# EasyEDA Pro project PCB_Source.epro

# Schematic Schematic1
Board Name: Board1; Create Date: 2026-05-20; Page Name: P1; Project Name: pcbwatch; Schematic Name: Schematic1; Update Date: 2026-05-27; Company: EasyEDA.com; Page Size: A4; Version: V1.0
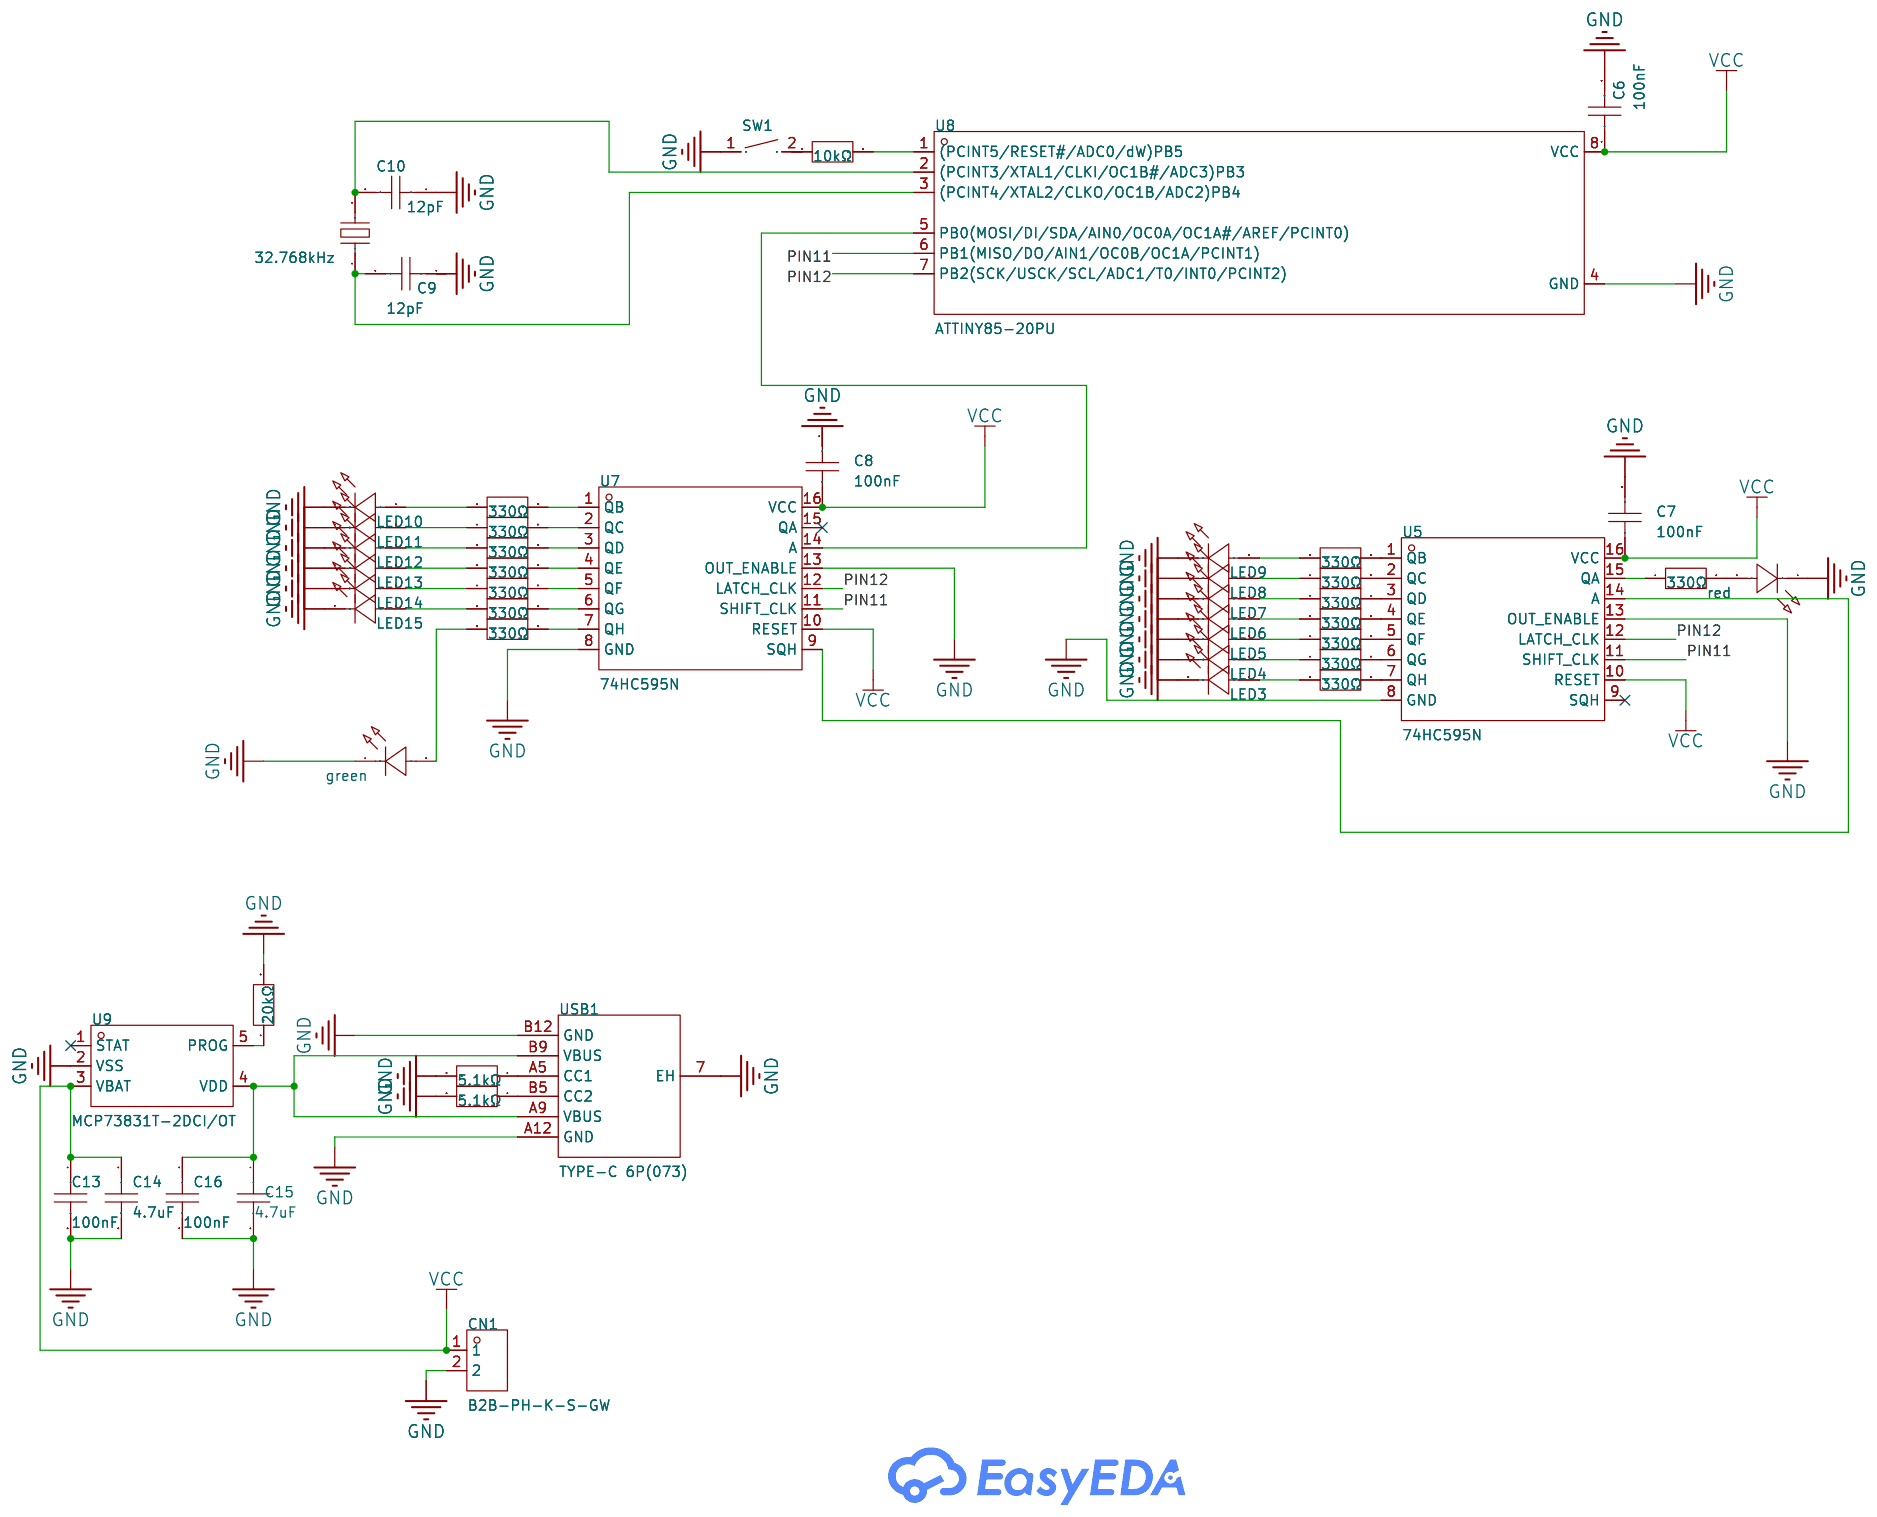
[diagram p0: schematic sheet]

## Parts
C6  100nF  [CAP-TH_L5.8-W2.4-P2.54-D0.6]
C7  100nF  [CAP-TH_L5.8-W2.4-P2.54-D0.6]
C8  100nF  [CAP-TH_L5.8-W2.4-P2.54-D0.6]
C9  12pF  [CAP-TH_L5.8-W2.4-P2.54-D0.6]
C10  12pF  [CAP-TH_L5.8-W2.4-P2.54-D0.6]
C13  100nF  [CAP-TH_L5.8-W2.4-P2.54-D0.6]
C14  4.7uF  [CAP-TH_L5.8-W2.4-P2.54-D0.6]
C15  4.7uF  [CAP-TH_L5.8-W2.4-P2.54-D0.6]
C16  100nF  [CAP-TH_L5.8-W2.4-P2.54-D0.6]
CN1  B2B-PH-K-S-GW  [CONN-TH_B2B-PH-K-S]
green  TJ-S2012EX8T5ALC2R-A5  [LED0805-RD]
LED3  TJ-S2012EX8T5ALC2R-A5  [LED0805-RD]
LED4  TJ-S2012EX8T5ALC2R-A5  [LED0805-RD]
LED5  TJ-S2012EX8T5ALC2R-A5  [LED0805-RD]
LED6  TJ-S2012EX8T5ALC2R-A5  [LED0805-RD]
LED7  TJ-S2012EX8T5ALC2R-A5  [LED0805-RD]
LED8  TJ-S2012EX8T5ALC2R-A5  [LED0805-RD]
LED9  TJ-S2012EX8T5ALC2R-A5  [LED0805-RD]
LED10  TJ-S2012EX8T5ALC2R-A5  [LED0805-RD]
LED11  TJ-S2012EX8T5ALC2R-A5  [LED0805-RD]
LED12  TJ-S2012EX8T5ALC2R-A5  [LED0805-RD]
LED13  TJ-S2012EX8T5ALC2R-A5  [LED0805-RD]
LED14  TJ-S2012EX8T5ALC2R-A5  [LED0805-RD]
LED15  TJ-S2012EX8T5ALC2R-A5  [LED0805-RD]
R20  330Ω  [RES-TH_BD2.3-L6.5-P10.50-D0.5]
R21  330Ω  [RES-TH_BD2.3-L6.5-P10.50-D0.5]
R22  330Ω  [RES-TH_BD2.3-L6.5-P10.50-D0.5]
R23  330Ω  [RES-TH_BD2.3-L6.5-P10.50-D0.5]
R24  330Ω  [RES-TH_BD2.3-L6.5-P10.50-D0.5]
R25  330Ω  [RES-TH_BD2.3-L6.5-P10.50-D0.5]
R26  330Ω  [RES-TH_BD2.3-L6.5-P10.50-D0.5]
R27  330Ω  [RES-TH_BD2.3-L6.5-P10.50-D0.5]
R28  330Ω  [RES-TH_BD2.3-L6.5-P10.50-D0.5]
R29  330Ω  [RES-TH_BD2.3-L6.5-P10.50-D0.5]
R30  330Ω  [RES-TH_BD2.3-L6.5-P10.50-D0.5]
R31  330Ω  [RES-TH_BD2.3-L6.5-P10.50-D0.5]
R32  330Ω  [RES-TH_BD2.3-L6.5-P10.50-D0.5]
R33  330Ω  [RES-TH_BD2.3-L6.5-P10.50-D0.5]
R34  330Ω  [RES-TH_BD2.3-L6.5-P10.50-D0.5]
R36  10kΩ  [RES-TH_BD2.3-L6.5-P10.50-D0.5]
R40  20kΩ  [RES-TH_BD2.3-L6.5-P10.50-D0.5]
R41  5.1kΩ  [RES-TH_BD2.3-L6.5-P10.50-D0.5]
R42  5.1kΩ  [RES-TH_BD2.3-L6.5-P10.50-D0.5]
red  TJ-S2012EX8T5ALC2R-A5  [LED0805-RD]
SW1  HX 3x4x2-2P-1.6N TACTILE SWITCH  [KEY-SMD_L4.0-W3.0-LS4.9-1]
U5  74HC595N  [DIP-16_L19.8-W6.5-P2.54-LS7.6-BL]
U7  74HC595N  [DIP-16_L19.8-W6.5-P2.54-LS7.6-BL]
U8  ATTINY85-20PU  [PDIP-8_L9.3-W6.4-P2.54-LS7.9-BL-1]
U9  MCP73831T-2DCI/OT  [SOT-23-5_L2.9-W1.6-P0.95-LS2.8-BL]
USB1  TYPE-C 6P(073)  [TYPE-C-SMD_TYPE-C-6P-073]
X1  32.768kHz  [OSC-TH_BD2.0-P0.70-D0.3]

## Library data of the parts
C6-C10 C13-C16 = CC1H104ZA1ED3F5P1100: Capacitance:100nF Tolerance:-20%~+80% Tolerance:-20%~+80% Voltage Rating:50V Pin Spacing:2.54mm Temperature Coefficient:Y5V Diameter:5.8mm Body Thickness:2.4mm; LCSC Part Name: 100nF -20%~+80% 50V; Supplier Part: C2832506; Manufacturer: Dersonic(德尔创); Supplier Footprint: 插件,P=2.54mm; JLCPCB Part Class: Extended Part; Datasheet: https://item.szlcsc.com/datasheet/CC1H104ZA1ED3F5P1100/2990644.html; Supplier: LCSC; Tolerance: -20%~+80%; Voltage Rating: 50V; Pin Spacing: 2.54mm; Temperature Coefficient: Y5V; Diameter: 5.8mm; Body Thickness: 2.4mm
CN1 = B2B-PH-K-S-GW: Pins Structure:1x2P Pitch:2mm Mounting Type:Through Hole Reference Series:PH Number of Pins:2P Number of Rows:1 Number of PINs Per Row:2 Row Spacing:- Current Rating:2A Contact Material:Brass Contact Plating:Tin Operating Temperature:-25℃~+85℃ Operating T; LCSC Part Name: 1x2P 间距:2mm 直插 系列:PH; Supplier Part: C5251182; Manufacturer: JST; Supplier Footprint: 插件,P=2mm; JLCPCB Part Class: Extended Part; Datasheet: https://item.szlcsc.com/datasheet/B2B-PH-K-S-GW/5967705.html; Supplier: LCSC; Pins Structure: 1x2P; Pitch: 2mm; Mounting Type: Through Hole; Reference Series: PH; Number of Pins: 2P; Number of Rows: 1; Number of PINs Per Row: 2; Current Rating: 2A; Contact Material: Brass; Contact Plating: Tin; Operating Temperature: -25℃~+85℃; Voltage Rating: 100V; Plastic Material: PA66; Flame Retardant Rating: UL94V-0; Supplementary Features: K Pin; Color: White; Z-Height of the Board: 6mm; X-Length of Bottom Edge on Board (Spacing Line): 5.9mm; Y-Width of Bottom Edge on Board: 4.5mm
green LED3-LED15 red = TJ-S2012EX8T5ALC2R-A5: Lamp Holder Type:2mm x 1.25mm square LED Illumination Color:Red Voltage - Forward(Vf):1.8V~2.4V Voltage - Forward(Vf):1.8V~2.4V Power(Watts):48mW Forward Current:20mA Wavelength - Dominant:620nm~630nm Wavelength - Dominant:620nm~630nm Peak Wavelength:631n; LCSC Part Name: SMD0805灯珠红光; Supplier Part: C48689647; Manufacturer: TOGIALED(统佳); Supplier Footprint: 0805; JLCPCB Part Class: Extended Part; Datasheet: https://item.szlcsc.com/datasheet/TJ-S2012EX8T5ALC2R-A5/50980865.html; Supplier: LCSC; Lamp Holder Type: 2mm x 1.25mm square LED; Illumination Color: Red; Voltage - Forward(Vf): 1.8V~2.4V; Power(Watts): 48mW; Forward Current: 20mA; Wavelength - Dominant: 620nm~630nm; Peak Wavelength: 631nm; Diode Configuration: Discrete Diode; Lens Color: Water Clear; Luminous Intensity: 200mcd; Viewing Angle: 120°; Operating Temperature: -40℃~+80℃
R20-R34 R36 R40-R42 = MF1/4W-1KΩ±1%T52: Type:Metal Film Resistors Resistance: Tolerance:±1% Tolerance:±1% Power(Watts):250mW Temperature Coefficient:±200ppm/℃ Temperature Coefficient:±200ppm/℃; LCSC Part Name: 金属膜电阻 1kΩ ±1% 250mW; Supplier Part: C713997; Manufacturer: 华星机电; Supplier Footprint: 插件,D2.3xL6.5mm; JLCPCB Part Class: Extended Part; Datasheet: https://atta.szlcsc.com/upload/public/pdf/source/20200731/C713882_AE8EB1102749D7E4FB4FB13DC898C429.pdf; Supplier: LCSC; Type: Metal Film Resistors; Tolerance: ±1%; Power(Watts): 250mW; Temperature Coefficient: ±200ppm/℃
SW1 = HX 3x4x2-2P-1.6N TACTILE SWITCH: Circuit:SPST Actuator Style:Round Button Operating Force:1.6N Mounting Type:Surface Mount,Vertical Length:4mm Width:3mm Switch Height:2mm with Bracket:Without Bracket Contact Current:50mA Voltage Rating:12V Actuator/Cap Color:Black With Lamp:No IP Rating:; LCSC Part Name: 4*3*2mm 立贴 轻触开关; Supplier Part: C49234124; Manufacturer: hanxia(韩下); Supplier Footprint: SMD; JLCPCB Part Class: Extended Part; Datasheet: https://item.szlcsc.com/datasheet/HX%25203x4x2-2P-1.6N%2520TACTILE%2520SWITCH/51650185.html; Supplier: LCSC; Circuit: SPST; Actuator Style: Round Button; Operating Force: 1.6N; Mounting Type: Surface Mount,Vertical; Length: 4mm; Width: 3mm; Switch Height: 2mm; with Bracket: Without Bracket; Contact Current: 50mA; Voltage Rating: 12V; Actuator/Cap Color: Black; With Lamp: No; Termination Style: SMD(SMT) Tab; Life: 100,000 Cycles
U5 U7 = 74HC595N: Function:Serial-to-Serial or Parallel Voltage - Supply:2V~6V Voltage - Supply:2V~6V Clock Frequency:28MHz Number of Elements:1 Number of Bits per Element:8 Output Type:Tri-State Series:74HC Operating Temperature:-55℃~+125℃ Operating Temperature:-55℃~+125℃; LCSC Part Name: 停产 74HC595N; Supplier Part: C669328; Manufacturer: HTC; Supplier Footprint: DIP-16; JLCPCB Part Class: Extended Part; Datasheet: https://item.szlcsc.com/datasheet/74HC595N/699730.html; Supplier: LCSC; Function: Serial-to-Serial or Parallel; Voltage - Supply: 2V~6V; Clock Frequency: 28MHz; Number of Elements: 1; Number of Bits per Element: 8; Output Type: Tri-State; Series: 74HC; Operating Temperature: -55℃~+125℃
U8 = ATTINY85-20PU: CPU Core:AVR CPU Maximum Speed:20MHz Core Size:8 Bit Program Storage Size:8KB Program Memory Type:FLASH RAM Size:512Byte EEPROM:512Byte Number of I/O:6 ADC (Bit):10bit Oscillator Type:Built-in Voltage - Supply:2.7V~5.5V Voltage - Supply:2.7V~5.5V Operatin; Supplier Part: C965497; Manufacturer: MICROCHIP(美国微芯); Supplier Footprint: PDIP-8; JLCPCB Part Class: Extended Part; Datasheet: https://item.szlcsc.com/datasheet/ATTINY85-20PU/1052792.html; Supplier: LCSC; CPU Core: AVR; CPU Maximum Speed: 20MHz; Core Size: 8 Bit; Program Storage Size: 8KB; Program Memory Type: FLASH; RAM Size: 512Byte; EEPROM: 512Byte; Number of I/O: 6; ADC (Bit): 10bit; Oscillator Type: Built-in; Voltage - Supply: 2.7V~5.5V; Operating Temperature: -40℃~+85℃
U9 = MCP73831T-2DCI/OT: The Chip Type:Charging IC Voltage - Supply:3.75V~6V Voltage - Supply:3.75V~6V Charge Current - Max:550mA Charging Saturation Voltage:4.2V End-Off Voltage:- Type of Battery:Lithium Battery Number of Cells:1 Number of Cells:1 Operating Temperature:-40℃~+85℃; LCSC Part Name: 单节全集成锂离子/锂聚合物充电管理控制器; Supplier Part: C625597; Manufacturer: MICROCHIP(美国微芯); Supplier Footprint: SOT-23-5; JLCPCB Part Class: Extended Part; Datasheet: https://item.szlcsc.com/datasheet/MCP73831T-2DCI%252FOT/655504.html; Supplier: LCSC; The Chip Type: Charging IC; Voltage - Supply: 3.75V~6V; Charge Current - Max: 550mA; Charging Saturation Voltage: 4.2V; Type of Battery: Lithium Battery; Number of Cells: 1; Operating Temperature: -40℃~+85℃; Battery Temperature Detection: Not supported; Supply Current (Iq): 53uA
USB1 = TYPE-C 6P(073): Connector Type:Type-C Protocol Standard:- Gender:Female Mounting Type:Surface Mount, Right Angle Number of Contacts:6P Number of Ports:1 Current Rating-Power:3A Voltage Rating:5V Connect-Disconnect Life:10,000 Cycles Supplementary Features:- Center Height; LCSC Part Name: 6P卧贴母座; Supplier Part: C668623; Manufacturer: SHOU HAN(首韩); Supplier Footprint: SMD; JLCPCB Part Class: Extended Part; Datasheet: https://item.szlcsc.com/datasheet/TYPE-C%25206P(073)/698566.html; Supplier: LCSC; Connector Type: Type-C; Gender: Female; Mounting Type: Surface Mount, Right Angle; Number of Contacts: 6P; Number of Ports: 1; Current Rating-Power: 3A; Voltage Rating: 5V; Connect-Disconnect Life: 10,000 Cycles; Detection color: Black; Operating Temperature: -25℃~+85℃
X1 = TAXD32768K2BGBBZT2S: Type:Through Hole Crystal Oscillator Frequency:32.768kHz Normal temperature Frequency Tolerance:±10ppm Normal temperature Frequency Tolerance:±10ppm Load Capacitance:12.5pF Frequency Stability:±20ppm Frequency Stability:±20ppm Equivalent Series Resistance; LCSC Part Name: 32.768kHz ±10ppm 12.5pF; Supplier Part: C511702; Manufacturer: YJX(雅晶鑫); Supplier Footprint: DT-26; JLCPCB Part Class: Extended Part; Datasheet: https://item.szlcsc.com/datasheet/TAXD32768K2BGBBZT2S/526449.html; Supplier: LCSC; Type: Through Hole Crystal Oscillator; Normal temperature Frequency Tolerance: ±10ppm; Load Capacitance: 12.5pF; Frequency Stability: ±20ppm; Equivalent Series Resistance(ESR): 40kΩ; Operating Temperature: -20℃~+70℃

## Nets
GND: C6.2 C7.2 C8.1 C9.1 C10.1 C13.2 C14.2 C15.2 C16.2 CN1.2 green.1(C) LED3.1(C) LED4.1(C) LED5.1(C) LED6.1(C) LED7.1(C) LED8.1(C) LED9.1(C) LED10.1(C) LED11.1(C) LED12.1(C) LED13.1(C) LED14.1(C) LED15.1(C) R40.2 R41.2 R42.2 red.1(C) SW1.1 U5.8(GND) U5.13(OUT_ENABLE) U7.8(GND) U7.13(OUT_ENABLE) U8.4(GND) U9.2(VSS) USB1.7(EH) USB1.A12(GND) USB1.B12(GND)
VCC: C6.1 C7.1 C8.2 C13.1 C14.1 CN1.1 U5.10(RESET) U5.16(VCC) U7.10(RESET) U7.16(VCC) U8.8(VCC) U9.3(VBAT)
PIN11: U5.11(SHIFT_CLK) U7.11(SHIFT_CLK) U8.6(PB1(MISO/DO/AIN1/OC0B/OC1A/PCINT1))
PIN12: U5.12(LATCH_CLK) U7.12(LATCH_CLK) U8.7(PB2(SCK/USCK/SCL/ADC1/T0/INT0/PCINT2))
$1N1454: U7.14(A) U8.5(PB0(MOSI/DI/SDA/AIN0/OC0A/OC1A#/AREF/PCINT0))
$1N1740: U5.14(A) U7.9(SQH)
$1N15518: R40.1 U9.5(PROG)
Net-(C9-2): C9.2 U8.3((PCINT4/XTAL2/CLKO/OC1B/ADC2)PB4) X1.1
Net-(C10-2): C10.2 U8.2((PCINT3/XTAL1/CLKI/OC1B#/ADC3)PB3) X1.2
Net-(C15-1): C15.1 C16.1 U9.4(VDD) USB1.A9(VBUS) USB1.B9(VBUS)
Net-(green-2): green.2(A) R26.1
Net-(LED3-2): LED3.2(A) R33.1
Net-(LED4-2): LED4.2(A) R32.1
Net-(LED5-2): LED5.2(A) R31.1
Net-(LED6-2): LED6.2(A) R30.1
Net-(LED7-2): LED7.2(A) R29.1
Net-(LED8-2): LED8.2(A) R28.1
Net-(LED9-2): LED9.2(A) R27.1
Net-(LED10-2): LED10.2(A) R20.1
Net-(LED11-2): LED11.2(A) R21.1
Net-(LED12-2): LED12.2(A) R22.1
Net-(LED13-2): LED13.2(A) R23.1
Net-(LED14-2): LED14.2(A) R24.1
Net-(LED15-2): LED15.2(A) R25.1
Net-(R20-2): R20.2 U7.1(QB)
Net-(R21-2): R21.2 U7.2(QC)
Net-(R22-2): R22.2 U7.3(QD)
Net-(R23-2): R23.2 U7.4(QE)
Net-(R24-2): R24.2 U7.5(QF)
Net-(R25-2): R25.2 U7.6(QG)
Net-(R26-2): R26.2 U7.7(QH)
Net-(R27-2): R27.2 U5.1(QB)
Net-(R28-2): R28.2 U5.2(QC)
Net-(R29-2): R29.2 U5.3(QD)
Net-(R30-2): R30.2 U5.4(QE)
Net-(R31-2): R31.2 U5.5(QF)
Net-(R32-2): R32.2 U5.6(QG)
Net-(R33-2): R33.2 U5.7(QH)
Net-(R34-1): R34.1 U5.15(QA)
Net-(R34-2): R34.2 red.2(A)
Net-(R36-1): R36.1 SW1.2
Net-(R36-2): R36.2 U8.1((PCINT5/RESET#/ADC0/dW)PB5)
Net-(R41-1): R41.1 USB1.A5(CC1)
Net-(R42-1): R42.1 USB1.B5(CC2)

Not connected (* = marked no-connect by the designer): U5 9(SQH)*; U7 15(QA)*; U9 1(STAT)*

# Board PCB1
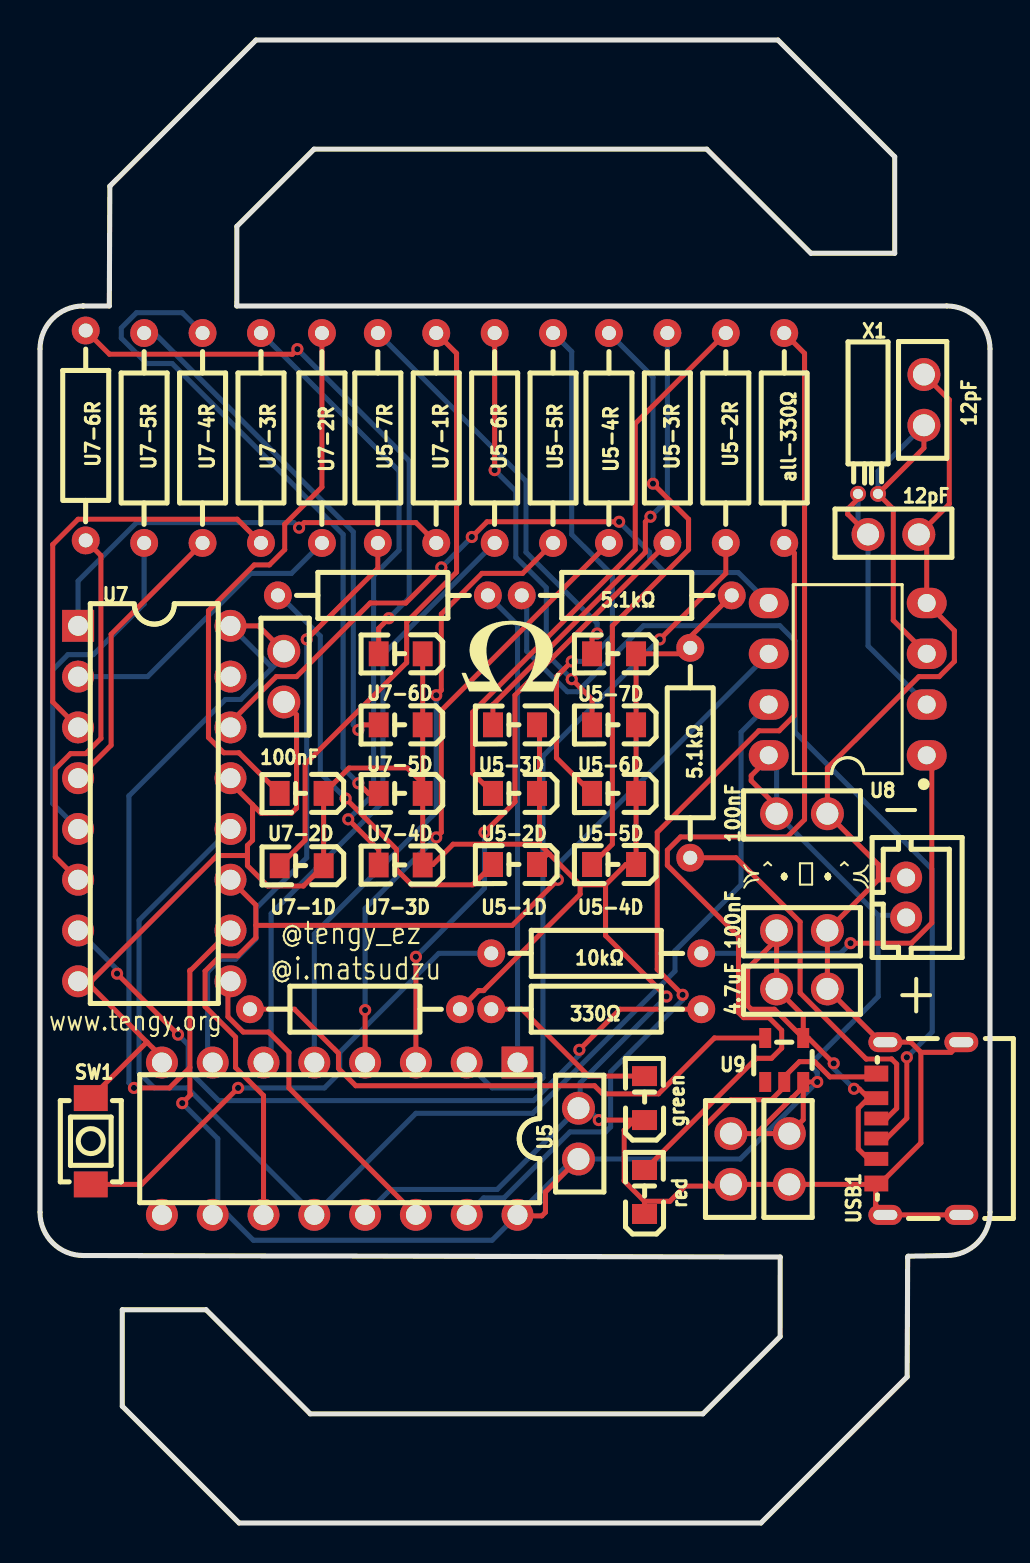
[diagram p1: board, top side]
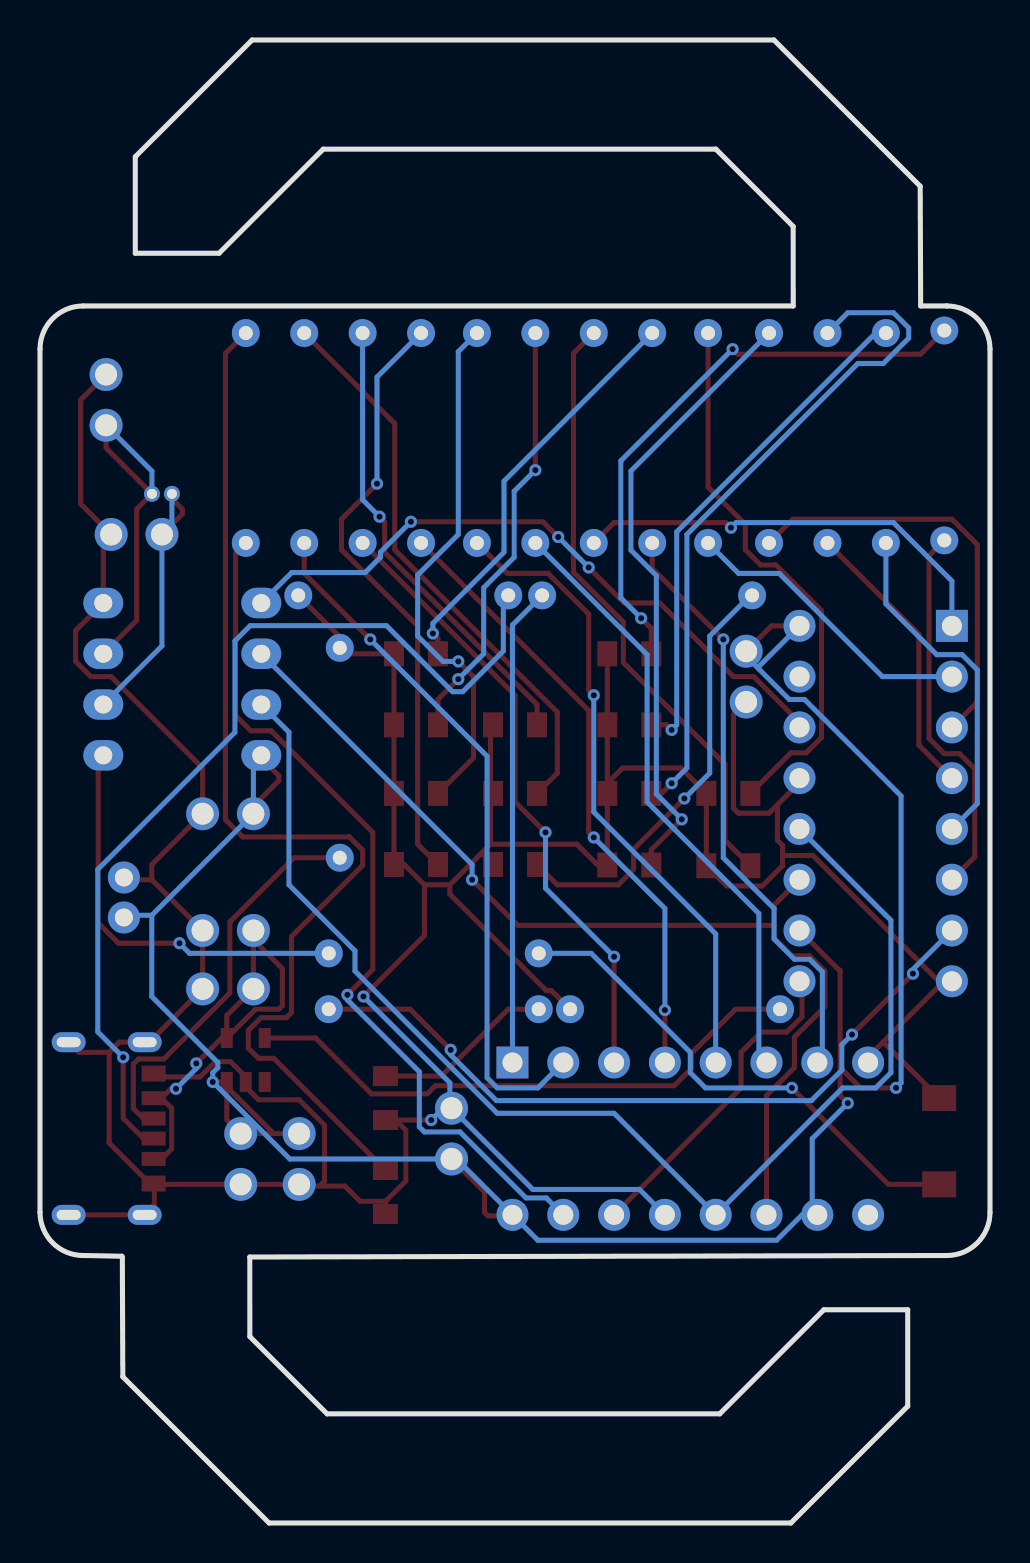
[diagram p2: board, bottom side, seen from below]

Outline 47.5 x 74.19 mm; copper layers: Top Layer, Bottom Layer. Coordinates in mm from the lower left corner of the outline.
Outline path: 0,58.72 arc(0.63,60.25) 2.16,60.88 2.15,60.88 3.47,60.88 3.49,66.87 10.8,74.19 36.89,74.19 42.73,68.35 42.73,63.52 38.54,63.52 33.34,68.73 13.71,68.73 9.84,64.86 9.84,60.88 45.34,60.88 arc(46.87,60.25) 47.5,58.72 47.5,15.54 arc(46.87,14.01) 45.34,13.38 43.41,13.35 43.38,13.31 43.36,7.31 36.05,0 9.96,0 4.11,5.84 4.11,10.67 8.31,10.67 13.51,5.46 33.14,5.46 37.01,9.33 37.01,13.31 2.16,13.38 arc(0.63,14.01) 0,15.54 0,58.72
Stack: Top Layer 0.035mm / Dielectric1 1.51mm FR4 er 4.5 / Bottom Layer 0.035mm

## Design rules (mm)
template: JLCPCB Capability(Two Layers Board)
spacing copperThickness1oz (default): track to track 0.102, other pairs 0.152 to 0.3
spacing copperThickness2oz: track to track 0.203, other pairs 0.152 to 0.3
track width copperThickness1oz (default): min 0.127, default 0.254, max 2.54
track width copperThickness2oz: min 0.203, default 0.254, max 2.54
differential pair differentialPair (default): width min 0.127, default 0.254, max 2.54; gap min 0.152, default 0.152
via viaSize (default): diameter min 0.5, default 0.61, max 10; hole min 0.3, default 0.305, max 6.3

## Placement (name value [footprint] x y rotation side)
3A  4.7uF  [CAP-TH_L5.8-W2.4-P2.54-D0.6]  37.47 18.21 270 top
3B  100nF  [CAP-TH_L5.8-W2.4-P2.54-D0.6]  34.54 18.21 270 top
4.7uF  4.7uF  [CAP-TH_L5.8-W2.4-P2.54-D0.6]  38.1 26.72 0 top
5.1kΩ  -  [RES-TH_BD2.3-L6.5-P10.50-D0.5]  29.34 46.4 0 top
5.1kΩ#2  -  [RES-TH_BD2.3-L6.5-P10.50-D0.5]  32.51 38.53 90 top
10kΩ  10kΩ  [RES-TH_BD2.3-L6.5-P10.50-D0.5]  27.81 28.5 0 top
12pF  -  [CAP-TH_L5.8-W2.4-P2.54-D0.6]  44.2 56.18 270 top
12pF#2  -  [CAP-TH_L5.8-W2.4-P2.54-D0.6]  42.67 49.45 180 top
100nF  -  [CAP-TH_L5.8-W2.4-P2.54-D0.6]  38.1 29.64 0 top
100nF#2  -  [CAP-TH_L5.8-W2.4-P2.54-D0.6]  38.1 35.48 0 top
100nF#3  -  [CAP-TH_L5.8-W2.4-P2.54-D0.6]  12.19 42.34 90 top
330Ω  330Ω  [RES-TH_BD2.3-L6.5-P10.50-D0.5]  27.81 25.7 0 top
all-330Ω  330Ω  [RES-TH_BD2.3-L6.5-P10.50-D0.5]  37.21 54.28 90 top
C7  100nF  [CAP-TH_L5.8-W2.4-P2.54-D0.6]  26.92 19.48 90 top
CN1  B2B-PH-K-S-GW  [CONN-TH_B2B-PH-K-S]  43.31 31.29 270 top
green  TJ-S2012EX8T5ALC2R-A5  [LED0805-RD]  30.23 21.26 90 top
R40  20kΩ  [RES-TH_BD2.3-L6.5-P10.50-D0.5]  15.75 25.7 0 top
red  TJ-S2012EX8T5ALC2R-A5  [LED0805-RD]  30.23 16.56 90 top
SW1  HX 3x4x2-2P-1.6N TACTILE SWITCH  [KEY-SMD_L4.0-W3.0-LS4.9-1]  2.54 19.1 270 top
U5  74HC595N  [DIP-16_L19.8-W6.5-P2.54-LS7.6-BL]  14.99 19.23 180 top
U5-1D  TJ-S2012EX8T5ALC2R-A5  [LED0805-RD]  23.75 32.94 180 top
U5-1R  330Ω  [RES-TH_BD2.3-L6.5-P10.50-D0.5]  17.14 46.4 0 top
U5-2D  TJ-S2012EX8T5ALC2R-A5  [LED0805-RD]  23.75 36.5 180 top
U5-2R  330Ω  [RES-TH_BD2.3-L6.5-P10.50-D0.5]  34.29 54.28 270 top
U5-3D  TJ-S2012EX8T5ALC2R-A5  [LED0805-RD]  23.75 39.93 180 top
U5-3R  330Ω  [RES-TH_BD2.3-L6.5-P10.50-D0.5]  31.37 54.28 270 top
U5-4D  TJ-S2012EX8T5ALC2R-A5  [LED0805-RD]  28.7 32.94 180 top
U5-4R  330Ω  [RES-TH_BD2.3-L6.5-P10.50-D0.5]  28.45 54.28 270 top
U5-5D  TJ-S2012EX8T5ALC2R-A5  [LED0805-RD]  28.7 36.5 180 top
U5-5R  330Ω  [RES-TH_BD2.3-L6.5-P10.50-D0.5]  25.65 54.28 270 top
U5-6D  TJ-S2012EX8T5ALC2R-A5  [LED0805-RD]  28.7 39.93 180 top
U5-6R  330Ω  [RES-TH_BD2.3-L6.5-P10.50-D0.5]  22.73 54.28 270 top
U5-7D  TJ-S2012EX8T5ALC2R-A5  [LED0805-RD]  28.7 43.48 180 top
U5-7R  330Ω  [RES-TH_BD2.3-L6.5-P10.50-D0.5]  16.89 54.28 270 top
U7  74HC595N  [DIP-16_L19.8-W6.5-P2.54-LS7.6-BL]  5.72 35.99 270 top
U7-1D  TJ-S2012EX8T5ALC2R-A5  [LED0805-RD]  13.08 32.88 180 top
U7-1R  330Ω  [RES-TH_BD2.3-L6.5-P10.50-D0.5]  19.81 54.28 270 top
U7-2D  TJ-S2012EX8T5ALC2R-A5  [LED0805-RD]  13.08 36.5 180 top
U7-2R  330Ω  [RES-TH_BD2.3-L6.5-P10.50-D0.5]  14.1 54.28 270 top
U7-3D  TJ-S2012EX8T5ALC2R-A5  [LED0805-RD]  18.04 32.92 180 top
U7-3R  330Ω  [RES-TH_BD2.3-L6.5-P10.50-D0.5]  11.05 54.28 270 top
U7-4D  TJ-S2012EX8T5ALC2R-A5  [LED0805-RD]  18.03 36.5 180 top
U7-4R  330Ω  [RES-TH_BD2.3-L6.5-P10.50-D0.5]  8.13 54.28 270 top
U7-5D  TJ-S2012EX8T5ALC2R-A5  [LED0805-RD]  18.03 39.93 180 top
U7-5R  330Ω  [RES-TH_BD2.3-L6.5-P10.50-D0.5]  5.21 54.28 270 top
U7-6D  TJ-S2012EX8T5ALC2R-A5  [LED0805-RD]  18.03 43.48 180 top
U7-6R  330Ω  [RES-TH_BD2.3-L6.5-P10.50-D0.5]  2.29 54.41 270 top
U8  ATTINY85-20PU  [PDIP-8_L9.3-W6.4-P2.54-LS7.9-BL-1]  40.39 42.21 90 top
U9  MCP73831T-2DCI/OT  [SOT-23-5_L2.9-W1.6-P0.95-LS2.8-BL]  37.21 23.16 0 top
USB1  TYPE-C 6P(073)  [TYPE-C-SMD_TYPE-C-6P-073]  43.94 19.73 90 top
X1  32.768kHz  [OSC-TH_BD2.0-P0.70-D0.3]  41.4 51.48 270 top

## Footprints (pads in the part's own frame, mm; a bottom-side part is the same pattern mirrored in y, then rotated)
CAP-TH_L5.8-W2.4-P2.54-D0.6
  round 1.65 hole 1.1: 1(-1.27,0) 2(1.27,0)
CONN-TH_B2B-PH-K-S
  round 1.6 hole 0.9: 1(1,0) 2(-1,0)
DIP-16_L19.8-W6.5-P2.54-LS7.6-BL
  rect 1.6x1.6 hole 1: 1(-8.89,-3.81)
  round 1.6 hole 1: 2(-6.35,-3.81) 3(-3.81,-3.81) 4(-1.27,-3.81) 5(1.27,-3.81) 6(3.81,-3.81) 7(6.35,-3.81) 8(8.89,-3.81) 9(8.89,3.81) 10(6.35,3.81) 11(3.81,3.81) 12(1.27,3.81) 13(-1.27,3.81) 14(-3.81,3.81) 15(-6.35,3.81) 16(-8.89,3.81)
KEY-SMD_L4.0-W3.0-LS4.9-1
  rect 1.3x1.7 smd: 1(-2.159,0) 2(2.159,0)
LED0805-RD
  rect 1x1.25 smd: 1(-1.1,0) 2(1.1,0)
OSC-TH_BD2.0-P0.70-D0.3
  round 0.8 hole 0.5: 1(0,0.5) 2(0,-0.5)
PDIP-8_L9.3-W6.4-P2.54-LS7.9-BL-1
  oval 1.524x2 hole 0.9: 1(-3.81,-3.95) 2(-1.27,-3.95) 3(1.27,-3.95) 4(3.81,-3.95) 5(3.81,3.95) 6(1.27,3.95) 7(-1.27,3.95) 8(-3.81,3.95)
RES-TH_BD2.3-L6.5-P10.50-D0.5
  round 1.4 hole 0.7: 1(-5.25,0) 2(5.25,0)
SOT-23-5_L2.9-W1.6-P0.95-LS2.8-BL
  rect 0.6x1 smd: 1(-0.95,-1.1) 2(0,-1.1) 3(0.95,-1.1) 4(0.95,1.1) 5(-0.95,1.1)
TYPE-C-SMD_TYPE-C-6P-073
  oval 1x1.7 hole 0.5x1.2: 7(-4.32,1.675) 7(-4.32,-2.125) 7(4.32,1.675) 7(4.32,-2.125)
  rect 0.7x1.2 smd: A5(-0.5,2.125) A9(1.52,2.125) B5(0.5,2.125) B9(-1.52,2.125)
  rect 0.8x1.2 smd: A12(2.75,2.125) B12(-2.75,2.125)

## Nets
GND: 3A.2 3B.2 4.7uF.2 5.1kΩ.2 5.1kΩ#2.2 12pF.1 12pF#2.1 100nF.2 100nF#2.2 100nF#3.1 C7.2 CN1.2 green.1 R40.2 red.1 SW1.1 U5.8 U5.13 U5-1D.1 U5-2D.1 U5-3D.1 U5-4D.1 U5-5D.1 U5-6D.1 U5-7D.1 U7.8 U7.13 U7-1D.1 U7-2D.1 U7-3D.1 U7-4D.1 U7-5D.1 U7-6D.1 U8.4 U9.2 USB1.7 USB1.A12 USB1.B12
VCC: 3A.1 3B.1 100nF#2.1 100nF#3.2 C7.1 CN1.1 U5.10 U5.16 U7.10 U7.16 U8.8 U9.3
PIN11: U5.11 U7.11 U8.6
PIN12: U5.12 U7.12 U8.7
$1N1454: U7.14 U8.5
$1N1740: U5.14 U7.9
$1N3175: U5-5D.2 U5-5R.1
$1N3221: U5-4D.2 U5-4R.1
$1N3267: U5-3D.2 U5-3R.1
$1N3313: U5-2D.2 U5-2R.1
$1N3359: U5-1D.2 U5-1R.1
$1N7289: U7-1D.2 U7-1R.1
$1N7335: U7-2D.2 U7-2R.1
$1N7381: U7-3D.2 U7-3R.1
$1N7427: U7-4D.2 U7-4R.1
$1N7473: U7-5D.2 U7-5R.1
$1N7519: U7-6D.2 U7-6R.1
$1N7565: 330Ω.1 green.2
$1N8990: U5-6D.2 U5-6R.1
$1N8994: U5-7D.2 U5-7R.1
$1N10884: all-330Ω.1 U5.15
$1N10886: all-330Ω.2 red.2
$1N10962: 10kΩ.2 U8.1
$1N10964: 10kΩ.1 SW1.2
$1N11563: U5.1 U5-1R.2
$1N11565: U5.2 U5-2R.2
$1N11567: U5.3 U5-3R.2
$1N11569: U5.4 U5-4R.2
$1N11571: U5.5 U5-5R.2
$1N11573: U5.6 U5-6R.2
$1N11575: U5.7 U5-7R.2
$1N11659: U7.1 U7-1R.2
$1N11661: U7.2 U7-2R.2
$1N11663: U7.3 U7-3R.2
$1N11665: U7.4 U7-4R.2
$1N11667: U7.5 U7-5R.2
$1N11669: U7.6 U7-6R.2
$1N11671: 330Ω.2 U7.7
$1N11673: U7.15
$1N13466: 12pF#2.2 U8.2 X1.2
$1N13478: 12pF.2 U8.3 X1.1
$1N15286: 4.7uF.1 100nF.1 U9.4 USB1.A9 USB1.B9
$1N15518: R40.1 U9.5
$1N16011: 5.1kΩ#2.1 USB1.B5
$1N16013: 5.1kΩ.1 USB1.A5

Pads without a net: U5 9; U9 1

## Via types
v1: diameter 0.61, hole 0.305, Top Layer to Bottom Layer, 38 vias

## Routing (per net, layer and track width the routed paths; a pad name or vN(x,y) marks a point on that pad's centre or on a via; arc(x,y) is an arc through that point)
GND: length 225.6
  Top Layer w0.254: 12pF.1 45.47,56.18 45.47,50.98 12pF#2.1 44.34,49.06 U8.4 45.72,44.64 45.72,43.1 44.96,42.34 43.94,42.34 39.37,37.77 100nF#2.2 41.91,32.94 41.91,32.18 ; 19.14,36.5 U7-3D.1 19.16,32.94 19.64,32.94 20.66,33.96 24.98,33.96 ; 10.37,33.39 8.85,33.39 2.56,27.1 ; 10.37,33.39 10.37,32.88 11.39,31.87 13.17,31.87 U7-1D.1 ; 10.37,33.39 10.37,33.9 10.63,34.15 10.63,35.93 ; v1(27.94,20.16) 29.72,20.16 ; 29.72,20.16 green.1 ; 29.72,20.16 29.21,19.65 29.21,17.11 30.22,16.09 ; 2.56,27.1 U7.8 ; 2.56,27.1 2.56,26.85 5.35,24.05 ; 24.98,36.5 24.98,39.8 U5-3D.1 ; 24.98,36.5 24.98,33.96 ; 24.98,36.5 U5-2D.1 ; 44.04,23.55 45.56,23.55 USB1.7 ; 44.04,23.55 43.54,24.05 USB1.7 42.03,24.05 4.7uF.2 100nF.2 41.91,32.18 ; 44.04,23.55 44.04,19.02 42.01,16.98 USB1.B12 41.78,16.94 ; R40.2 21.93,26.63 22.18,26.63 27.01,31.46 27.01,31.93 ; 41.78,16.94 41.78,15.9 USB1.7 USB1.7 ; 41.78,16.94 3A.2 3B.2 34.46,16.86 33.53,16.86 ; 30.22,16.09 31.49,16.09 32.26,16.86 33.53,16.86 ; 30.22,16.09 30.22,15.46 ; U5-1D.1 25.36,33.45 25.48,33.45 ; 33.53,16.86 33.27,17.11 33.27,19.9 34.54,21.17 36.57,21.17 37.21,21.81 U9.2 37.21,22.32 37.97,23.08 38.73,23.08 39.5,22.32 41.65,22.32 USB1.A12 ; 28.28,31.93 27.01,31.93 ; 28.28,31.93 28.28,29.39 v1(31.33,26.34) ; 28.28,31.93 29.29,32.94 U5-4D.1 U5-5D.1 U5-6D.1 U5-7D.1 32.22,43.48 5.1kΩ#2.2 32.51,44.33 5.1kΩ.2 ; 27.01,31.93 25.48,33.45 ; 100nF#3.1 12.83,40.44 12.83,35.76 12.57,35.51 11.05,35.51 10.63,35.93 ; 5.35,24.05 5.33,24.05 SW1.1 ; 5.35,24.05 6.1,23.31 6.1,23.04 ; 14.18,32.88 U7-2D.1 15.45,37.77 18.37,37.77 19.13,37.01 ; 24.98,33.96 25.48,33.45 ; U7-6D.1 U7-5D.1 19.13,37.01 ; 41.91,32.18 43.2,32.18 CN1.2 ; 19.13,37.01 U7-4D.1 ; U7.13 9.53,37.03 10.63,35.93
  Bottom Layer w0.254: v1(31.33,26.34) 27.01,22.02 27.01,20.83 ; 27.01,20.83 27.26,20.83 v1(27.94,20.16) ; 27.01,20.83 C7.2 22.86,16.69 17.53,16.69 U5.13
VCC: length 125.1
  Top Layer w0.254: 7.49,22.78 6.48,21.77 v1(4.7,21.77) ; 7.49,22.78 7.49,27.61 ; 7.49,22.78 7.49,21.44 ; 38.16,21.82 38.16,20.18 3A.1 35.81,19.48 ; 38.16,21.82 U9.3 v1(38.86,22.06) ; 38.16,21.82 37.63,21.28 37.62,21.28 35.81,19.48 ; U5.16 23.93,15.36 25.09,15.36 25.27,15.54 25.27,16.56 C7.1 ; U8.8 36.44,38.26 35.56,37.39 35.56,37.13 36.83,35.86 100nF#2.1 ; 7.49,27.61 U7.10 ; 7.49,27.61 7.49,27.66 ; 35.81,19.48 3B.1 ; v1(7.11,21) 7.54,21.44 ; U7.16 10.92,44.88 100nF#3.2
  Bottom Layer w0.254: 8.89,15.42 U5.10 ; 8.89,15.42 8.89,19.23 v1(7.11,21) ; 8.89,15.42 9.4,15.42 10.67,14.15 22.61,14.15 U5.16 26.67,18.21 C7.1 35.01,18.21 v1(38.86,22.06) 38.86,22.53 38.61,22.78 38.61,23.04 41.91,26.34 41.91,30.4 ; U7.16 11.56,42.85 11.56,42.72 ; 41.91,30.4 43.2,30.4 CN1.1 ; 41.91,30.4 100nF#2.1 36.83,38.01 U8.8 ; 100nF#3.2 12.19,43.36 11.56,42.72 ; v1(4.7,21.77) 4.44,22.02 4.44,36.37 9.27,41.2 10.03,41.2 11.56,42.72
PIN11: length 51.8
  Top Layer w0.254: 10.79,29.89 10.79,29.28 9.89,28.37 9.02,28.37 8.25,27.61 8.25,25.83 9.78,24.31 9.78,22.78 11.18,21.39 U5.11 ; 10.79,29.89 10.79,30.91 U7.11 ; 10.79,29.89 23.61,29.89 v1(25.89,32.18)
  Bottom Layer w0.254: v1(25.89,32.18) 25.89,32.94 U8.6
PIN12: length 64.2
  Bottom Layer w0.254: U8.7 35.05,39.56 35.05,31.93 31.75,28.62 31.75,27.61 24.64,20.5 18.8,20.5 13.72,15.42 7.37,21.77 5.72,21.77 4.95,22.53 4.95,30.15 U7.12
$1N1454: length 33.2
  Top Layer w0.254: v1(20.07,47.8) 18.29,46.02 16.51,46.02 12.83,42.34 11.81,42.34 9.53,40.05 U7.14 ; v1(28.96,50.09) 22.35,50.09 v1(21.59,49.33)
  Bottom Layer w0.254: v1(28.96,50.09) 30.48,48.56 30.48,48.31 31.24,47.55 34.91,47.55 U8.5 ; v1(20.07,47.8) v1(21.59,49.33)
$1N1740: length 16.4
  Top Layer w0.254: U5.14 12.45,21.77 12.45,23.54 11.43,24.56 10.16,24.56 9.4,25.32 9.4,26.97 U7.9
$1N3175: length 26.6
  Top Layer w0.254: U5-5D.2 25.82,38.28 25.82,42.34 v1(26.59,43.1)
  Bottom Layer w0.254: v1(26.59,43.1) 27.35,43.1 28.62,44.37 28.62,47.42 26.59,49.45 26.59,58.6 U5-5R.1
$1N3221: length 30.2
  Top Layer w0.254: v1(30.65,51.99) 32.43,50.21 32.43,48.69 28.62,44.88 28.62,33.96 U5-4D.2
  Bottom Layer w0.254: U5-4R.1 30.65,57.33 v1(30.65,51.99)
$1N3267: length 23.2
  Top Layer w0.254: U5-3D.2 22.65,40.94 30.27,48.56 30.27,50.09 v1(30.52,50.34)
  Bottom Layer w0.254: U5-3R.1 31.37,51.19 v1(30.52,50.34)
$1N3313: length 28.7
  Top Layer w0.254: U5-2R.1 29.76,55 29.76,48.69 21.63,40.56 21.63,37.51 U5-2D.2
$1N3359: length 21.8
  Top Layer w0.254: v1(15.28,36.24) 17.82,33.7 17.82,32.69 18.59,31.93 21.63,31.93 U5-1D.2
  Bottom Layer w0.254: v1(15.28,36.24) 14.01,37.51 14.01,44.37 11.98,46.4 U5-1R.1
$1N7289: length 30.7
  Top Layer w0.254: U7-1R.1 20.83,58.51 20.83,47.57 18.33,45.07 18.33,43.04 13.25,37.96 13.25,34.15 U7-1D.2
$1N7335: length 27.7
  Top Layer w0.254: U7-2D.2 9.95,38.53 9.19,38.53 8.42,39.29 8.42,45.64 10.71,47.93 11.47,47.93 12.23,48.69 12.23,49.96 14.1,51.82 U7-2R.1
$1N7381: length 31.2
  Top Layer w0.254: U7-3D.2 16.94,33.68 v1(15.41,35.2)
  Bottom Layer w0.254: v1(15.41,35.2) 16.68,36.47 16.68,47.39 17.95,48.66 17.95,52.63 U7-3R.1
$1N7427: length 34.5
  Top Layer w0.254: U7-4D.2 16.43,36.5 v1(15.92,37.01)
  Bottom Layer w0.254: U7-4R.1 7.11,60.54 4.83,60.54 4.06,59.78 4.06,59.27 5.33,58 6.6,58 15.16,49.45 15.16,37.77 v1(15.92,37.01)
$1N7473: length 25.7
  Top Layer w0.254: v1(15.92,39.67) 16.17,39.93 U7-5D.2
  Bottom Layer w0.254: U7-5R.1 5.72,59.53 15.66,49.58 15.66,39.93 v1(15.92,39.67)
$1N7519: length 29.4
  Top Layer w0.254: v1(17.44,45.26) 16.93,44.75 U7-6D.2 ; U7-6R.1 3.47,58.47 12.62,58.47 v1(12.87,58.72)
  Bottom Layer w0.254: v1(12.87,58.72) 18.46,53.14 18.46,46.28 v1(17.44,45.26)
$1N7565: length 9
  Top Layer w0.254: 330Ω.1 24.09,25.7 27.43,22.36 green.2
$1N8990: length 21.6
  Top Layer w0.254: v1(26.59,42.21) 27.6,41.2 U5-6D.2 ; v1(22.73,52.67) U5-6R.1
  Bottom Layer w0.254: v1(22.73,52.67) 23.79,51.61 23.79,48.31 25.32,46.79 25.32,43.48 v1(26.59,42.21)
$1N8994: length 20.7
  Top Layer w0.254: U5-7D.2 27.6,44.25 v1(27.86,44.5)
  Bottom Layer w0.254: v1(27.86,44.5) 27.86,45.01 24.3,48.56 24.3,52.12 U5-7R.1
$1N10884: length 43.9
  Top Layer w0.254: all-330Ω.1 37.72,48.52 37.72,40.39 36.96,39.63 35.94,39.63 30.86,34.55 30.86,27.69 v1(32.13,26.42)
  Bottom Layer w0.254: v1(32.13,26.42) 32.13,26.17 28.53,22.57 28.53,19.82 28.28,19.56 26.5,19.56 23.2,16.26 22.18,16.26 U5.15
$1N10886: length 54.7
  Top Layer w0.254: red.2 35.81,23.25 36.58,23.25 37.08,23.76 37.08,24.64 36.45,25.28 35.18,25.28 34.92,25.53 34.92,29.34 31.37,32.9 31.37,33.66 32.03,34.32 37.36,34.32 38.23,35.19 38.23,58.51 all-330Ω.2
$1N10962: length 20.6
  Top Layer w0.254: v1(40.53,29.01) 43.57,29.01 44.59,30.02 44.59,38.15 U8.1
  Bottom Layer w0.254: v1(40.53,29.01) 40.02,28.5 10kΩ.2
$1N10964: length 25.4
  Top Layer w0.254: v1(9.91,21.77) 5.08,16.94 2.54,16.94
  Bottom Layer w0.254: v1(9.91,21.77) 14.22,21.77 14.99,22.53 14.99,23.54 19.94,28.5 10kΩ.1
$1N11563: length 24
  Bottom Layer w0.254: U5-1R.2 23.88,44.92 U5.1
$1N11565: length 35.1
  Top Layer w0.254: v1(30.99,44.2) 34.29,47.5 U5-2R.2
  Bottom Layer w0.254: U5.2 22.61,21.77 24.64,21.77 25.15,22.27 25.15,38.36 v1(30.99,44.2)
$1N11567: length 31.2
  Top Layer w0.254: v1(18.8,28.33) U5.3 ; U5-3R.2 23.75,41.41 23.75,36.07 v1(22.22,34.55)
  Bottom Layer w0.254: v1(22.22,34.55) 22.22,31.76 v1(18.8,28.33)
$1N11569: length 31
  Top Layer w0.254: v1(19.81,34.3) 20.07,34.55 20.07,40.65 U5-4R.2 ; v1(16.26,25.66) U5.4
  Bottom Layer w0.254: v1(19.81,34.3) 16.26,30.74 v1(16.26,25.66)
$1N11571: length 32.1
  Top Layer w0.254: U5-5R.2 24.13,47.5 22.1,47.5 20.07,45.47 20.07,41.66 v1(19.81,41.41)
  Bottom Layer w0.254: 13.72,23.04 13.72,29.47 19.81,35.57 v1(19.81,41.41)
$1N11573: length 30.8
  Bottom Layer w0.254: U5.6 11.56,23.42 11.56,30.49 17.14,36.07 17.14,43.44 U5-6R.2
$1N11575: length 30.1
  Top Layer w0.254: U5-7R.2 16.89,47.76 v1(13.34,44.2)
  Bottom Layer w0.254: v1(13.34,44.2) 13.34,33.28 10.79,30.74 10.79,29.22 9.78,28.2 9.02,28.2 8.38,27.57 8.38,23.29 U5.7
$1N11659: length 22
  Top Layer w0.254: U7-1R.2 18.8,50.04 13.21,50.04 v1(12.95,49.79)
  Bottom Layer w0.254: v1(12.95,49.79) 12.7,50.04 4.83,50.04 1.91,47.12 U7.1
$1N11661: length 15
  Bottom Layer w0.254: U7-2R.2 12.57,47.5 10.54,47.5 5.38,42.34 U7.2
$1N11663: length 21.1
  Top Layer w0.254: U7-3R.2 9.86,50.21 1.91,50.21 0.63,48.94 0.63,41.07 U7.3
$1N11665: length 14.3
  Top Layer w0.254: U7.4 3.56,38.91 3.56,44.46 U7-4R.2
$1N11667: length 17.5
  Bottom Layer w0.254: U7.5 0.63,35.99 0.63,42.68 1.4,43.44 2.67,43.44 5.21,45.98 U7-5R.2
$1N11669: length 19.2
  Top Layer w0.254: U7-6R.2 3.05,48.39 3.05,39.25 2.29,38.49 1.52,38.49 0.76,37.73 0.76,33.32 U7.6
$1N11671: length 37.6
  Top Layer w0.254: v1(26.97,23.67) 29,25.7 330Ω.2 ; v1(6.9,24.43) v1(3.85,27.48)
  Bottom Layer w0.254: v1(3.85,27.48) 3.85,27.69 U7.7 ; v1(6.9,24.43) 7.41,23.93 7.41,22.66 8.93,21.13 24.68,21.13 26.97,23.42 v1(26.97,23.67)
$1N13466: length 14.6
  Top Layer w0.254: X1.2 40.9,51.24 40.39,50.72 40.39,50.47 12pF#2.2
  Bottom Layer w0.254: U8.2 41.4,43.88 12pF#2.2 40.9,49.95 X1.2
$1N13478: length 17.8
  Top Layer w0.254: 12pF.2 44.2,53.78 X1.1 42.66,50.72 42.66,45.16 U8.3
  Bottom Layer w0.254: 12pF.2 41.9,52.62 X1.1
$1N15286: length 22.2
  Top Layer w0.254: 41.42,21.25 40.95,21.72 v1(40.7,21.72) ; 41.42,21.25 40.92,20.75 40.92,18.71 41.42,18.21 USB1.B9 ; 41.42,21.25 USB1.A9 ; U9.4 38.16,25.39 4.7uF.1 36.83,29.18 ; U9.4 38.41,24.26 v1(39.69,22.99) ; U9.4 36.72,25.7 35.56,25.7 35.38,25.88 35.38,27.74 36.83,29.18 ; 36.83,29.18 100nF.1
  Bottom Layer w0.254: v1(40.7,21.72) 39.69,22.74 v1(39.69,22.99)
$1N15518: length 29.1
  Top Layer w0.254: U9.5 33.72,24.26 30.93,21.47 28.13,21.47 27.73,21.88 15.79,21.88 14.92,22.74 14.92,23.5 12.72,25.7 R40.1
$1N16011: length 20.1
  Top Layer w0.254: 5.1kΩ#2.1 34.8,33.28 38.01,30.07 38.01,26.52 41.31,23.21 42.58,23.21 42.83,22.96 42.83,20.74 42.32,20.23 USB1.B5
$1N16013: length 48
  Top Layer w0.254: USB1.A5 42.32,19.23 43.34,20.25 v1(43.34,23.3)
  Bottom Layer w0.254: v1(43.34,23.3) 44.61,24.57 44.61,32.7 37.75,39.55 37.75,44.13 36.99,44.89 30.17,44.89 26.87,41.59 26.37,41.59 24.33,43.62 24.33,46.16 5.1kΩ.1

## Text on the board
Top Silkscreen Layer: www.tengy.org | @i.matsudzu | @tengy_ez | + | - | ≽^•⩊•^≼
